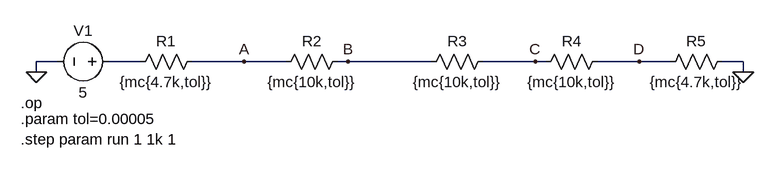
[diagram p0: schematic Lab2.asc]
Lab2.asc, the LTspice schematic file:
Version 4
SHEET 1 976 680
WIRE -416 -112 -448 -112
WIRE -288 -112 -336 -112
WIRE -128 -112 -208 -112
WIRE -64 -112 -128 -112
WIRE 32 -112 16 -112
WIRE 160 -112 32 -112
WIRE 320 -112 240 -112
WIRE 336 -112 320 -112
WIRE 480 -112 416 -112
WIRE 528 -112 480 -112
WIRE 640 -112 608 -112
WIRE -448 -96 -448 -112
WIRE 640 -96 640 -112
FLAG 640 -96 0
FLAG 32 -112 B
FLAG 320 -112 C
FLAG -448 -96 0
FLAG -128 -112 A
FLAG 480 -112 D
SYMBOL res -192 -128 R90
WINDOW 0 0 56 VBottom 2
WINDOW 3 32 56 VTop 2
SYMATTR InstName R1
SYMATTR Value {mc{4.7k,tol}}
SYMBOL res 32 -128 R90
WINDOW 0 0 56 VBottom 2
WINDOW 3 32 56 VTop 2
SYMATTR InstName R2
SYMATTR Value {mc{10k,tol}}
SYMBOL res 256 -128 R90
WINDOW 0 0 56 VBottom 2
WINDOW 3 32 56 VTop 2
SYMATTR InstName R3
SYMATTR Value {mc{10k,tol}}
SYMBOL res 432 -128 R90
WINDOW 0 0 56 VBottom 2
WINDOW 3 32 56 VTop 2
SYMATTR InstName R4
SYMATTR Value {mc{10k,tol}}
SYMBOL res 624 -128 R90
WINDOW 0 0 56 VBottom 2
WINDOW 3 32 56 VTop 2
SYMATTR InstName R5
SYMATTR Value {mc{4.7k,tol}}
SYMBOL voltage -320 -112 R90
WINDOW 0 -32 56 VBottom 2
WINDOW 3 32 56 VTop 2
WINDOW 123 0 0 Left 0
WINDOW 39 0 0 Left 0
SYMATTR InstName V1
SYMATTR Value 5
TEXT -472 -48 Left 2 !.op
TEXT -472 -24 Left 2 !.param tol=0.00005
TEXT -472 8 Left 2 !.step param run 1 1k 1

The netlist it stands for:
* Lab2.asc
R1 A N001 {mc{4.7k,tol}}
R2 B A {mc{10k,tol}}
R3 C B {mc{10k,tol}}
R4 D C {mc{10k,tol}}
R5 0 D {mc{4.7k,tol}}
V1 N001 0 5
.op
.param tol=0.00005
.step param run 1 1k 1
.backanno
.end